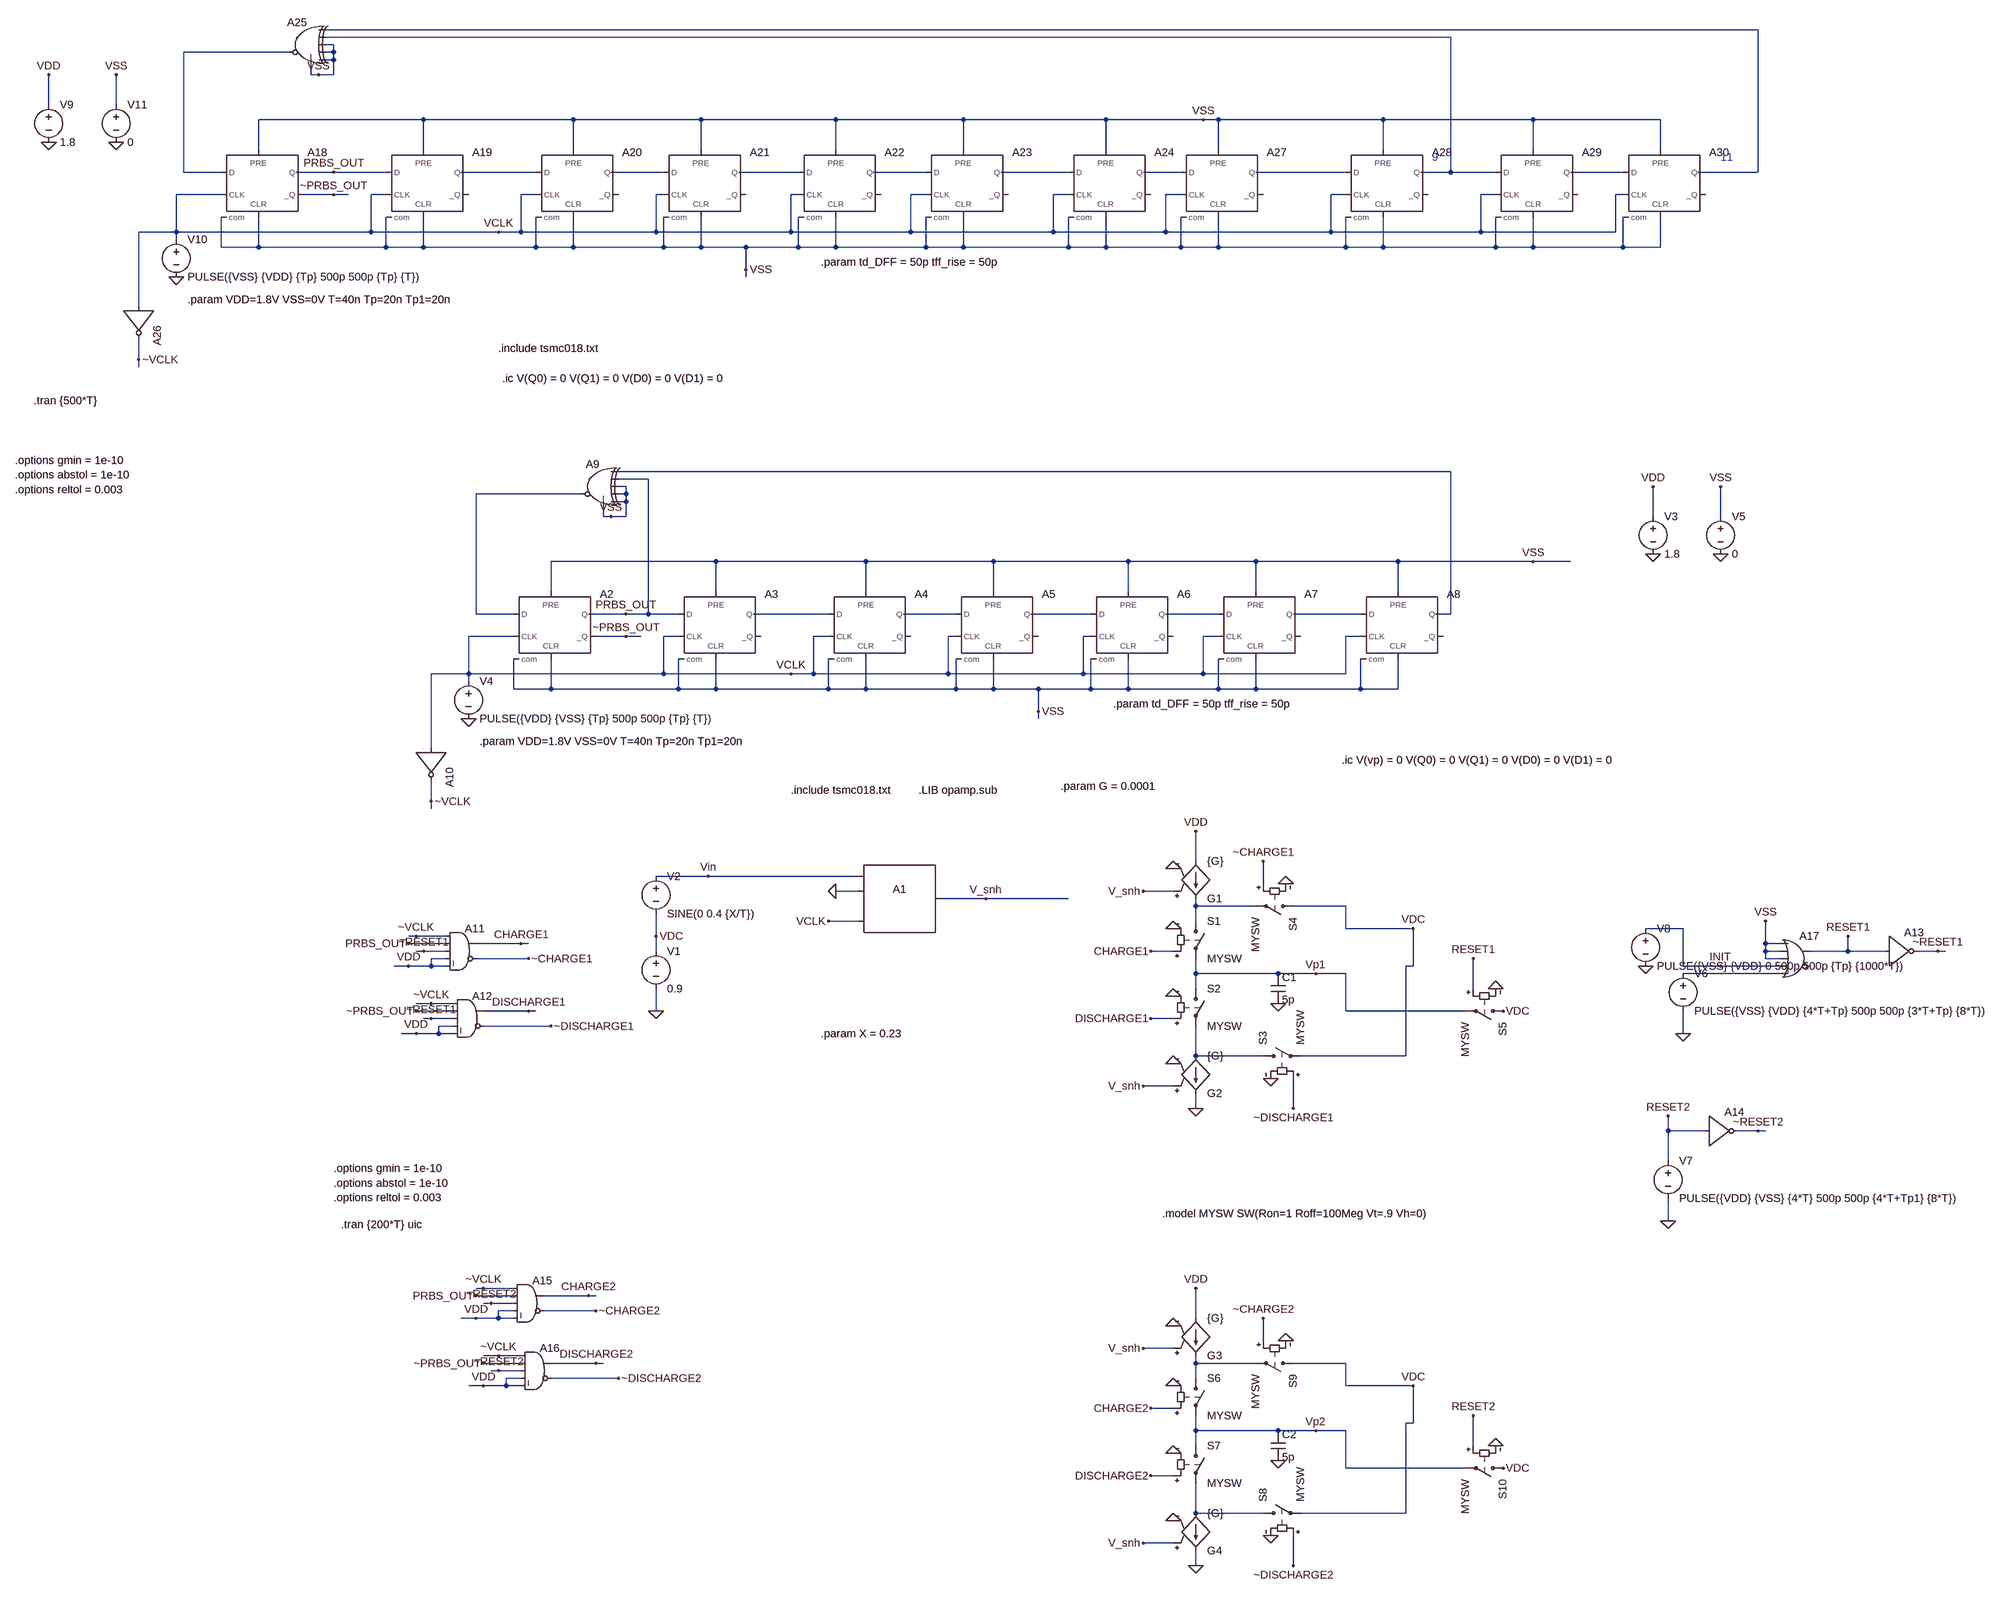
[diagram p0: schematic Draft3.asc]
Draft3.asc, the LTspice schematic file:
Version 4
SHEET 1 1940 1384
WIRE 1360 -2128 -1696 -2128
WIRE 704 -2112 -1696 -2112
WIRE -1680 -2096 -1696 -2096
WIRE -1776 -2080 -2000 -2080
WIRE -1680 -2080 -1680 -2096
WIRE -1680 -2080 -1696 -2080
WIRE -1680 -2064 -1680 -2080
WIRE -1680 -2064 -1696 -2064
WIRE -1728 -2032 -1728 -2064
WIRE -1712 -2032 -1728 -2032
WIRE -1680 -2032 -1680 -2064
WIRE -1680 -2032 -1712 -2032
WIRE -2288 -1968 -2288 -2032
WIRE -2144 -1968 -2144 -2032
WIRE -1488 -1936 -1840 -1936
WIRE -1168 -1936 -1488 -1936
WIRE -896 -1936 -1168 -1936
WIRE -608 -1936 -896 -1936
WIRE -336 -1936 -608 -1936
WIRE -32 -1936 -336 -1936
WIRE 176 -1936 -32 -1936
WIRE 208 -1936 176 -1936
WIRE 560 -1936 208 -1936
WIRE 880 -1936 560 -1936
WIRE 1152 -1936 880 -1936
WIRE -1840 -1872 -1840 -1936
WIRE -1488 -1872 -1488 -1936
WIRE -1168 -1872 -1168 -1936
WIRE -896 -1872 -896 -1936
WIRE -608 -1872 -608 -1936
WIRE -336 -1872 -336 -1936
WIRE -32 -1872 -32 -1936
WIRE 208 -1872 208 -1936
WIRE 560 -1872 560 -1936
WIRE 880 -1872 880 -1936
WIRE 1152 -1872 1152 -1936
WIRE -2000 -1824 -2000 -2080
WIRE -1920 -1824 -2000 -1824
WIRE -1680 -1824 -1760 -1824
WIRE -1568 -1824 -1680 -1824
WIRE -1248 -1824 -1408 -1824
WIRE -976 -1824 -1088 -1824
WIRE -688 -1824 -816 -1824
WIRE -416 -1824 -528 -1824
WIRE -112 -1824 -256 -1824
WIRE 128 -1824 48 -1824
WIRE 480 -1824 288 -1824
WIRE 704 -1824 704 -2112
WIRE 704 -1824 640 -1824
WIRE 800 -1824 704 -1824
WIRE 1072 -1824 960 -1824
WIRE 1360 -1824 1360 -2128
WIRE 1360 -1824 1232 -1824
WIRE -1920 -1776 -2016 -1776
WIRE -1680 -1776 -1744 -1776
WIRE -1648 -1776 -1680 -1776
WIRE -1568 -1776 -1600 -1776
WIRE -1248 -1776 -1280 -1776
WIRE -976 -1776 -992 -1776
WIRE -688 -1776 -704 -1776
WIRE -416 -1776 -448 -1776
WIRE -112 -1776 -144 -1776
WIRE 128 -1776 96 -1776
WIRE 480 -1776 448 -1776
WIRE 800 -1776 768 -1776
WIRE 1072 -1776 1056 -1776
WIRE -2016 -1696 -2016 -1776
WIRE -2016 -1696 -2096 -1696
WIRE -1600 -1696 -1600 -1776
WIRE -1600 -1696 -2016 -1696
WIRE -1328 -1696 -1600 -1696
WIRE -1280 -1696 -1280 -1776
WIRE -1280 -1696 -1328 -1696
WIRE -992 -1696 -992 -1776
WIRE -992 -1696 -1280 -1696
WIRE -704 -1696 -704 -1776
WIRE -704 -1696 -992 -1696
WIRE -448 -1696 -448 -1776
WIRE -448 -1696 -704 -1696
WIRE -144 -1696 -144 -1776
WIRE -144 -1696 -448 -1696
WIRE 96 -1696 96 -1776
WIRE 96 -1696 -144 -1696
WIRE 448 -1696 448 -1776
WIRE 448 -1696 96 -1696
WIRE 768 -1696 768 -1776
WIRE 768 -1696 448 -1696
WIRE 1056 -1696 1056 -1776
WIRE 1056 -1696 768 -1696
WIRE -2016 -1680 -2016 -1696
WIRE -1920 -1664 -1920 -1728
WIRE -1840 -1664 -1840 -1728
WIRE -1840 -1664 -1920 -1664
WIRE -1568 -1664 -1568 -1728
WIRE -1568 -1664 -1840 -1664
WIRE -1488 -1664 -1488 -1728
WIRE -1488 -1664 -1568 -1664
WIRE -1248 -1664 -1248 -1728
WIRE -1248 -1664 -1488 -1664
WIRE -1168 -1664 -1168 -1728
WIRE -1168 -1664 -1248 -1664
WIRE -976 -1664 -976 -1728
WIRE -976 -1664 -1168 -1664
WIRE -896 -1664 -896 -1728
WIRE -896 -1664 -976 -1664
WIRE -800 -1664 -896 -1664
WIRE -688 -1664 -688 -1728
WIRE -688 -1664 -800 -1664
WIRE -608 -1664 -608 -1728
WIRE -608 -1664 -688 -1664
WIRE -416 -1664 -416 -1728
WIRE -416 -1664 -608 -1664
WIRE -336 -1664 -336 -1728
WIRE -336 -1664 -416 -1664
WIRE -112 -1664 -112 -1728
WIRE -112 -1664 -336 -1664
WIRE -32 -1664 -32 -1728
WIRE -32 -1664 -112 -1664
WIRE 128 -1664 128 -1728
WIRE 128 -1664 -32 -1664
WIRE 208 -1664 208 -1728
WIRE 208 -1664 128 -1664
WIRE 480 -1664 480 -1728
WIRE 480 -1664 208 -1664
WIRE 560 -1664 560 -1728
WIRE 560 -1664 480 -1664
WIRE 800 -1664 800 -1728
WIRE 800 -1664 560 -1664
WIRE 880 -1664 880 -1728
WIRE 880 -1664 800 -1664
WIRE 1072 -1664 1072 -1728
WIRE 1072 -1664 880 -1664
WIRE 1152 -1664 1152 -1728
WIRE 1152 -1664 1072 -1664
WIRE -800 -1616 -800 -1664
WIRE -800 -1600 -800 -1616
WIRE -2096 -1536 -2096 -1696
WIRE -2096 -1424 -2096 -1472
WIRE -2096 -1408 -2096 -1424
WIRE 704 -1168 -1072 -1168
WIRE -1008 -1152 -1072 -1152
WIRE -1056 -1136 -1072 -1136
WIRE -1152 -1120 -1376 -1120
WIRE -1056 -1120 -1056 -1136
WIRE -1056 -1120 -1072 -1120
WIRE -1056 -1104 -1056 -1120
WIRE -1056 -1104 -1072 -1104
WIRE -1104 -1072 -1104 -1104
WIRE -1088 -1072 -1104 -1072
WIRE -1056 -1072 -1056 -1104
WIRE -1056 -1072 -1088 -1072
WIRE 1136 -1072 1136 -1136
WIRE 1280 -1072 1280 -1136
WIRE -864 -976 -1216 -976
WIRE -544 -976 -864 -976
WIRE -272 -976 -544 -976
WIRE 16 -976 -272 -976
WIRE 288 -976 16 -976
WIRE 592 -976 288 -976
WIRE 880 -976 592 -976
WIRE 960 -976 880 -976
WIRE -1216 -912 -1216 -976
WIRE -864 -912 -864 -976
WIRE -544 -912 -544 -976
WIRE -272 -912 -272 -976
WIRE 16 -912 16 -976
WIRE 288 -912 288 -976
WIRE 592 -912 592 -976
WIRE -1376 -864 -1376 -1120
WIRE -1296 -864 -1376 -864
WIRE -1056 -864 -1136 -864
WIRE -1008 -864 -1008 -1152
WIRE -1008 -864 -1056 -864
WIRE -944 -864 -1008 -864
WIRE -624 -864 -784 -864
WIRE -352 -864 -464 -864
WIRE -64 -864 -192 -864
WIRE 208 -864 96 -864
WIRE 512 -864 368 -864
WIRE 704 -864 704 -1168
WIRE 704 -864 672 -864
WIRE -1296 -816 -1392 -816
WIRE -1056 -816 -1120 -816
WIRE -1024 -816 -1056 -816
WIRE -944 -816 -976 -816
WIRE -624 -816 -656 -816
WIRE -352 -816 -368 -816
WIRE -64 -816 -80 -816
WIRE 208 -816 176 -816
WIRE 512 -816 480 -816
WIRE -1392 -736 -1392 -816
WIRE -1392 -736 -1472 -736
WIRE -976 -736 -976 -816
WIRE -976 -736 -1392 -736
WIRE -704 -736 -976 -736
WIRE -656 -736 -656 -816
WIRE -656 -736 -704 -736
WIRE -368 -736 -368 -816
WIRE -368 -736 -656 -736
WIRE -80 -736 -80 -816
WIRE -80 -736 -368 -736
WIRE 176 -736 176 -816
WIRE 176 -736 -80 -736
WIRE 480 -736 480 -816
WIRE 480 -736 176 -736
WIRE -1392 -720 -1392 -736
WIRE -1296 -704 -1296 -768
WIRE -1216 -704 -1216 -768
WIRE -1216 -704 -1296 -704
WIRE -944 -704 -944 -768
WIRE -944 -704 -1216 -704
WIRE -864 -704 -864 -768
WIRE -864 -704 -944 -704
WIRE -624 -704 -624 -768
WIRE -624 -704 -864 -704
WIRE -544 -704 -544 -768
WIRE -544 -704 -624 -704
WIRE -352 -704 -352 -768
WIRE -352 -704 -544 -704
WIRE -272 -704 -272 -768
WIRE -272 -704 -352 -704
WIRE -176 -704 -272 -704
WIRE -64 -704 -64 -768
WIRE -64 -704 -176 -704
WIRE 16 -704 16 -768
WIRE 16 -704 -64 -704
WIRE 208 -704 208 -768
WIRE 208 -704 16 -704
WIRE 288 -704 288 -768
WIRE 288 -704 208 -704
WIRE 512 -704 512 -768
WIRE 512 -704 288 -704
WIRE 592 -704 592 -768
WIRE 592 -704 512 -704
WIRE -176 -656 -176 -704
WIRE -176 -640 -176 -656
WIRE -1472 -576 -1472 -736
WIRE -1472 -464 -1472 -512
WIRE -1472 -448 -1472 -464
WIRE 160 -336 160 -400
WIRE -880 -304 -992 -304
WIRE -560 -304 -880 -304
WIRE 304 -288 304 -336
WIRE -560 -272 -608 -272
WIRE 112 -272 48 -272
WIRE -288 -256 -384 -256
WIRE -112 -256 -288 -256
WIRE 160 -240 160 -256
WIRE 288 -240 160 -240
WIRE 480 -240 368 -240
WIRE -560 -208 -624 -208
WIRE 160 -208 160 -240
WIRE 480 -192 480 -240
WIRE 624 -192 480 -192
WIRE 1200 -192 1120 -192
WIRE -1504 -176 -1520 -176
WIRE -1440 -176 -1504 -176
WIRE -992 -176 -992 -224
WIRE -1440 -160 -1520 -160
WIRE -1280 -160 -1376 -160
WIRE -1264 -160 -1280 -160
WIRE 1376 -160 1376 -208
WIRE 1408 -160 1376 -160
WIRE -1488 -144 -1504 -144
WIRE -1440 -144 -1488 -144
WIRE -992 -144 -992 -176
WIRE 112 -144 64 -144
WIRE 1376 -144 1376 -160
WIRE 1408 -144 1376 -144
WIRE 1552 -144 1552 -176
WIRE 1552 -144 1472 -144
WIRE 1632 -144 1552 -144
WIRE 1744 -144 1696 -144
WIRE 1760 -144 1744 -144
WIRE -1440 -128 -1472 -128
WIRE -1264 -128 -1376 -128
WIRE 1376 -128 1376 -144
WIRE 1408 -128 1376 -128
WIRE -1520 -112 -1552 -112
WIRE -1472 -112 -1472 -128
WIRE -1472 -112 -1520 -112
WIRE -1440 -112 -1472 -112
WIRE 624 -112 624 -192
WIRE 624 -112 608 -112
WIRE 1200 -112 1200 -192
WIRE 1280 -112 1200 -112
WIRE 1408 -112 1280 -112
WIRE 160 -96 160 -128
WIRE 336 -96 160 -96
WIRE 416 -96 336 -96
WIRE 480 -96 416 -96
WIRE 1408 -96 1200 -96
WIRE 160 -64 160 -96
WIRE 752 -64 752 -128
WIRE -1472 -32 -1504 -32
WIRE -1424 -32 -1472 -32
WIRE -1424 -16 -1504 -16
WIRE -1264 -16 -1360 -16
WIRE -1248 -16 -1264 -16
WIRE -992 -16 -992 -64
WIRE 480 -16 480 -96
WIRE 736 -16 480 -16
WIRE -1472 0 -1488 0
WIRE -1424 0 -1472 0
WIRE 112 0 64 0
WIRE -1424 16 -1456 16
WIRE -1216 16 -1360 16
WIRE -1504 32 -1536 32
WIRE -1456 32 -1456 16
WIRE -1456 32 -1504 32
WIRE -1424 32 -1456 32
WIRE 1200 32 1200 -16
WIRE 160 80 160 16
WIRE 304 80 160 80
WIRE 608 80 608 -112
WIRE 608 80 384 80
WIRE 112 144 48 144
WIRE 160 192 160 160
WIRE 368 192 368 128
WIRE 1168 240 1168 208
WIRE 1248 240 1168 240
WIRE 1360 240 1312 240
WIRE 1376 240 1360 240
WIRE 1168 304 1168 240
WIRE 1168 432 1168 384
WIRE -1360 576 -1376 576
WIRE -1296 576 -1360 576
WIRE -1296 592 -1376 592
WIRE -1136 592 -1232 592
WIRE -1120 592 -1136 592
WIRE -1344 608 -1360 608
WIRE -1296 608 -1344 608
WIRE -1296 624 -1328 624
WIRE -1120 624 -1232 624
WIRE -1376 640 -1408 640
WIRE -1328 640 -1328 624
WIRE -1328 640 -1376 640
WIRE -1296 640 -1328 640
WIRE 160 640 160 576
WIRE 304 688 304 640
WIRE 112 704 48 704
WIRE -1328 720 -1360 720
WIRE -1280 720 -1328 720
WIRE -1280 736 -1360 736
WIRE -1120 736 -1216 736
WIRE -1104 736 -1120 736
WIRE 160 736 160 720
WIRE 288 736 160 736
WIRE 480 736 368 736
WIRE -1328 752 -1344 752
WIRE -1280 752 -1328 752
WIRE -1280 768 -1312 768
WIRE -1072 768 -1216 768
WIRE 160 768 160 736
WIRE -1360 784 -1392 784
WIRE -1312 784 -1312 768
WIRE -1312 784 -1360 784
WIRE -1280 784 -1312 784
WIRE 480 784 480 736
WIRE 624 784 480 784
WIRE 112 832 64 832
WIRE 624 864 624 784
WIRE 624 864 608 864
WIRE 160 880 160 848
WIRE 336 880 160 880
WIRE 416 880 336 880
WIRE 480 880 416 880
WIRE 160 912 160 880
WIRE 752 912 752 848
WIRE 480 960 480 880
WIRE 736 960 480 960
WIRE 112 976 64 976
WIRE 160 1056 160 992
WIRE 304 1056 160 1056
WIRE 608 1056 608 864
WIRE 608 1056 384 1056
WIRE 112 1120 48 1120
WIRE 160 1168 160 1136
WIRE 368 1168 368 1104
FLAG -992 -16 0
FLAG -992 -176 VDC
FLAG -880 -304 Vin
FLAG -608 -272 0
FLAG 1136 -992 0
FLAG 1136 -1136 VDD
FLAG -624 -208 VCLK
FLAG -288 -256 V_snh
FLAG -1392 -640 0
FLAG -1088 -1072 VSS
FLAG -176 -656 VSS
FLAG -1056 -864 PRBS_OUT
FLAG -1056 -816 ~PRBS_OUT
FLAG 880 -976 VSS
FLAG -704 -736 VCLK
FLAG -1472 -464 ~VCLK
FLAG 160 192 0
FLAG 160 -400 VDD
FLAG 336 -32 0
FLAG 112 96 0
FLAG 112 -320 0
FLAG 416 -96 Vp1
FLAG 624 -192 VDC
FLAG 48 -272 V_snh
FLAG 48 144 V_snh
FLAG 112 -192 0
FLAG 112 -48 0
FLAG 320 128 0
FLAG 352 -288 0
FLAG 800 -64 0
FLAG -1520 -160 PRBS_OUT
FLAG -1280 -160 CHARGE1
FLAG -1488 -144 ~RESET1
FLAG -1520 -112 VDD
FLAG -1504 -16 ~PRBS_OUT
FLAG -1264 -16 DISCHARGE1
FLAG -1472 0 ~RESET1
FLAG -1504 32 VDD
FLAG -1504 -176 ~VCLK
FLAG -1472 -32 ~VCLK
FLAG 64 -144 CHARGE1
FLAG 304 -336 ~CHARGE1
FLAG 64 0 DISCHARGE1
FLAG 368 192 ~DISCHARGE1
FLAG 752 -128 RESET1
FLAG -1264 -128 ~CHARGE1
FLAG -1216 16 ~DISCHARGE1
FLAG 1280 -992 0
FLAG 1280 -1136 VSS
FLAG 1200 32 0
FLAG 1552 -176 RESET1
FLAG 816 -16 VDC
FLAG 1744 -144 ~RESET1
FLAG 160 1168 0
FLAG 160 576 VDD
FLAG 336 944 0
FLAG 112 1072 0
FLAG 112 656 0
FLAG 416 880 Vp2
FLAG 624 784 VDC
FLAG 48 704 V_snh
FLAG 48 1120 V_snh
FLAG 112 784 0
FLAG 112 928 0
FLAG 320 1104 0
FLAG 352 688 0
FLAG 800 912 0
FLAG 64 832 CHARGE2
FLAG 304 640 ~CHARGE2
FLAG 64 976 DISCHARGE2
FLAG 368 1168 ~DISCHARGE2
FLAG 752 848 RESET2
FLAG 816 960 VDC
FLAG 1168 432 0
FLAG 1168 208 RESET2
FLAG 1360 240 ~RESET2
FLAG -1376 592 PRBS_OUT
FLAG -1136 592 CHARGE2
FLAG -1344 608 ~RESET2
FLAG -1376 640 VDD
FLAG -1360 736 ~PRBS_OUT
FLAG -1120 736 DISCHARGE2
FLAG -1328 752 ~RESET2
FLAG -1360 784 VDD
FLAG -1360 576 ~VCLK
FLAG -1328 720 ~VCLK
FLAG -1120 624 ~CHARGE2
FLAG -1072 768 ~DISCHARGE2
FLAG 1376 -208 VSS
FLAG 1120 -112 0
FLAG 1280 -112 INIT
FLAG -2288 -1888 0
FLAG -2288 -2032 VDD
FLAG -2016 -1600 0
FLAG -1712 -2032 VSS
FLAG -800 -1616 VSS
FLAG -1680 -1824 PRBS_OUT
FLAG -1680 -1776 ~PRBS_OUT
FLAG 176 -1936 VSS
FLAG -1328 -1696 VCLK
FLAG -2096 -1424 ~VCLK
FLAG -2144 -1888 0
FLAG -2144 -2032 VSS
SYMBOL voltage -992 -160 R0
WINDOW 123 0 0 Left 0
WINDOW 39 0 0 Left 0
SYMATTR InstName V1
SYMATTR Value 0.9
SYMBOL voltage -992 -320 R0
WINDOW 123 0 0 Left 0
WINDOW 39 0 0 Left 0
SYMATTR InstName V2
SYMATTR Value SINE(0 0.4 {X/T})
SYMBOL SpecialFunctions\\sample -480 -272 R0
SYMATTR InstName A1
SYMBOL voltage 1136 -1088 R0
WINDOW 123 0 0 Left 0
WINDOW 39 0 0 Left 0
SYMATTR InstName V3
SYMATTR Value 1.8
SYMBOL Digital\\dflop -1216 -912 R0
SYMATTR InstName A2
SYMATTR SpiceLine Trise = {tff_rise} Tfall = {tff_rise} Td = {td_DFF}
SYMATTR Value2 Vhigh = 1.8 Vlow = 0
SYMBOL Digital\\dflop -864 -912 R0
SYMATTR InstName A3
SYMATTR SpiceLine Trise = {tff_rise} Tfall = {tff_rise} Td = {td_DFF}
SYMATTR Value2 Vhigh = 1.8 Vlow = 0
SYMBOL Digital\\dflop -544 -912 R0
SYMATTR InstName A4
SYMATTR SpiceLine Trise = {tff_rise} Tfall = {tff_rise} Td = {td_DFF}
SYMATTR Value2 Vhigh = 1.8 Vlow = 0
SYMBOL Digital\\dflop -272 -912 R0
SYMATTR InstName A5
SYMATTR SpiceLine Trise = {tff_rise} Tfall = {tff_rise} Td = {td_DFF}
SYMATTR Value2 Vhigh = 1.8 Vlow = 0
SYMBOL Digital\\dflop 16 -912 R0
SYMATTR InstName A6
SYMATTR SpiceLine Trise = {tff_rise} Tfall = {tff_rise} Td = {td_DFF}
SYMATTR Value2 Vhigh = 1.8 Vlow = 0
SYMBOL Digital\\dflop 288 -912 R0
SYMATTR InstName A7
SYMATTR SpiceLine Trise = {tff_rise} Tfall = {tff_rise} Td = {td_DFF}
SYMATTR Value2 Vhigh = 1.8 Vlow = 0
SYMBOL Digital\\dflop 592 -912 R0
SYMATTR InstName A8
SYMATTR SpiceLine Trise = {tff_rise} Tfall = {tff_rise} Td = {td_DFF}
SYMATTR Value2 Vhigh = 1.8 Vlow = 0
SYMBOL Digital\\xor -1120 -1200 M0
SYMATTR InstName A9
SYMATTR Value2 Vhigh = 1.8 Vlow = 0
SYMATTR SpiceLine Trise = {tff_rise} Tfall = {tff_rise} Td = {td_DFF}
SYMBOL voltage -1392 -736 R0
WINDOW 123 0 0 Left 0
WINDOW 39 0 0 Left 0
SYMATTR InstName V4
SYMATTR Value PULSE({VDD} {VSS} {Tp} 500p 500p {Tp} {T})
SYMBOL Digital\\inv -1408 -576 R90
SYMATTR InstName A10
SYMATTR Value2 Vhigh = 1.8 Vlow = 0
SYMATTR SpiceLine Trise = {tff_rise} Tfall = {tff_rise} Td = {td_DFF}
SYMBOL g 160 -240 M180
SYMATTR InstName G1
SYMATTR Value {G}
SYMBOL g 160 176 M180
SYMATTR InstName G2
SYMATTR Value {G}
SYMBOL sw 160 -224 R0
SYMATTR InstName S1
SYMATTR Value MYSW
SYMBOL sw 160 -80 R0
SYMATTR InstName S2
SYMATTR Value MYSW
SYMBOL sw 288 80 R270
SYMATTR InstName S3
SYMATTR Value MYSW
SYMBOL sw 384 -240 R90
SYMATTR InstName S4
SYMATTR Value MYSW
SYMBOL cap 320 -96 R0
SYMATTR InstName C1
SYMATTR Value 5p
SYMBOL sw 832 -16 R90
SYMATTR InstName S5
SYMATTR Value MYSW
SYMBOL Digital\\and -1408 -208 R0
SYMATTR InstName A11
SYMATTR Value2 Vhigh = 1.8 Vlow = 0
SYMATTR SpiceLine Trise = {tff_rise} Tfall = {tff_rise} Td = {td_DFF}
SYMBOL Digital\\and -1392 -64 R0
SYMATTR InstName A12
SYMATTR Value2 Vhigh = 1.8 Vlow = 0
SYMATTR SpiceLine Trise = {tff_rise} Tfall = {tff_rise} Td = {td_DFF}
SYMBOL voltage 1280 -1088 R0
WINDOW 123 0 0 Left 0
WINDOW 39 0 0 Left 0
SYMATTR InstName V5
SYMATTR Value 0
SYMBOL voltage 1200 -112 R0
WINDOW 123 0 0 Left 0
WINDOW 39 0 0 Left 0
SYMATTR InstName V6
SYMATTR Value PULSE({VSS} {VDD} {4*T+Tp} 500p 500p {3*T+Tp} {8*T})
SYMBOL Digital\\inv 1632 -208 R0
SYMATTR InstName A13
SYMATTR Value2 Vhigh = 1.8 Vlow = 0
SYMATTR SpiceLine Trise = {tff_rise} Tfall = {tff_rise} Td = {td_DFF}
SYMBOL g 160 736 M180
SYMATTR InstName G3
SYMATTR Value {G}
SYMBOL g 160 1152 M180
SYMATTR InstName G4
SYMATTR Value {G}
SYMBOL sw 160 752 R0
SYMATTR InstName S6
SYMATTR Value MYSW
SYMBOL sw 160 896 R0
SYMATTR InstName S7
SYMATTR Value MYSW
SYMBOL sw 288 1056 R270
SYMATTR InstName S8
SYMATTR Value MYSW
SYMBOL sw 384 736 R90
SYMATTR InstName S9
SYMATTR Value MYSW
SYMBOL cap 320 880 R0
SYMATTR InstName C2
SYMATTR Value 5p
SYMBOL sw 832 960 R90
SYMATTR InstName S10
SYMATTR Value MYSW
SYMBOL voltage 1168 288 R0
WINDOW 123 0 0 Left 0
WINDOW 39 0 0 Left 0
SYMATTR InstName V7
SYMATTR Value PULSE({VDD} {VSS} {4*T} 500p 500p {4*T+Tp1} {8*T})
SYMBOL Digital\\inv 1248 176 R0
SYMATTR InstName A14
SYMATTR Value2 Vhigh = 1.8 Vlow = 0
SYMATTR SpiceLine Trise = {tff_rise} Tfall = {tff_rise} Td = {td_DFF}
SYMBOL Digital\\and -1264 544 R0
SYMATTR InstName A15
SYMATTR Value2 Vhigh = 1.8 Vlow = 0
SYMATTR SpiceLine Trise = {tff_rise} Tfall = {tff_rise} Td = {td_DFF}
SYMBOL Digital\\and -1248 688 R0
SYMATTR InstName A16
SYMATTR Value2 Vhigh = 1.8 Vlow = 0
SYMATTR SpiceLine Trise = {tff_rise} Tfall = {tff_rise} Td = {td_DFF}
SYMBOL Digital\\or 1440 -192 R0
SYMATTR InstName A17
SYMATTR Value2 Vhigh = 1.8 Vlow = 0
SYMATTR SpiceLine Trise = {tff_rise} Tfall = {tff_rise} Td = {td_DFF}
SYMBOL voltage 1120 -208 R0
WINDOW 123 0 0 Left 0
WINDOW 39 0 0 Left 0
SYMATTR InstName V8
SYMATTR Value PULSE({VSS} {VDD} 0 500p 500p {Tp} {1000*T})
SYMBOL voltage -2288 -1984 R0
WINDOW 123 0 0 Left 0
WINDOW 39 0 0 Left 0
SYMATTR InstName V9
SYMATTR Value 1.8
SYMBOL Digital\\dflop -1840 -1872 R0
SYMATTR InstName A18
SYMATTR SpiceLine Trise = {tff_rise} Tfall = {tff_rise} Td = {td_DFF}
SYMATTR Value2 Vhigh = 1.8 Vlow = 0
SYMBOL Digital\\dflop -1488 -1872 R0
SYMATTR InstName A19
SYMATTR SpiceLine Trise = {tff_rise} Tfall = {tff_rise} Td = {td_DFF}
SYMATTR Value2 Vhigh = 1.8 Vlow = 0
SYMBOL Digital\\dflop -1168 -1872 R0
SYMATTR InstName A20
SYMATTR SpiceLine Trise = {tff_rise} Tfall = {tff_rise} Td = {td_DFF}
SYMATTR Value2 Vhigh = 1.8 Vlow = 0
SYMBOL Digital\\dflop -896 -1872 R0
SYMATTR InstName A21
SYMATTR SpiceLine Trise = {tff_rise} Tfall = {tff_rise} Td = {td_DFF}
SYMATTR Value2 Vhigh = 1.8 Vlow = 0
SYMBOL Digital\\dflop -608 -1872 R0
SYMATTR InstName A22
SYMATTR SpiceLine Trise = {tff_rise} Tfall = {tff_rise} Td = {td_DFF}
SYMATTR Value2 Vhigh = 1.8 Vlow = 0
SYMBOL Digital\\dflop -336 -1872 R0
SYMATTR InstName A23
SYMATTR SpiceLine Trise = {tff_rise} Tfall = {tff_rise} Td = {td_DFF}
SYMATTR Value2 Vhigh = 1.8 Vlow = 0
SYMBOL Digital\\dflop -32 -1872 R0
SYMATTR InstName A24
SYMATTR SpiceLine Trise = {tff_rise} Tfall = {tff_rise} Td = {td_DFF}
SYMATTR Value2 Vhigh = 1.8 Vlow = 0
SYMBOL Digital\\xor -1744 -2160 M0
SYMATTR InstName A25
SYMATTR Value2 Vhigh = 1.8 Vlow = 0
SYMATTR SpiceLine Trise = {tff_rise} Tfall = {tff_rise} Td = {td_DFF}
SYMBOL voltage -2016 -1696 R0
WINDOW 123 0 0 Left 0
WINDOW 39 0 0 Left 0
SYMATTR InstName V10
SYMATTR Value PULSE({VSS} {VDD} {Tp} 500p 500p {Tp} {T})
SYMBOL Digital\\inv -2032 -1536 R90
SYMATTR InstName A26
SYMATTR Value2 Vhigh = 1.8 Vlow = 0
SYMATTR SpiceLine Trise = {tff_rise} Tfall = {tff_rise} Td = {td_DFF}
SYMBOL voltage -2144 -1984 R0
WINDOW 123 0 0 Left 0
WINDOW 39 0 0 Left 0
SYMATTR InstName V11
SYMATTR Value 0
SYMBOL Digital\\dflop 208 -1872 R0
SYMATTR InstName A27
SYMATTR SpiceLine Trise = {tff_rise} Tfall = {tff_rise} Td = {td_DFF}
SYMATTR Value2 Vhigh = 1.8 Vlow = 0
SYMBOL Digital\\dflop 560 -1872 R0
SYMATTR InstName A28
SYMATTR SpiceLine Trise = {tff_rise} Tfall = {tff_rise} Td = {td_DFF}
SYMATTR Value2 Vhigh = 1.8 Vlow = 0
SYMBOL Digital\\dflop 880 -1872 R0
SYMATTR InstName A29
SYMATTR SpiceLine Trise = {tff_rise} Tfall = {tff_rise} Td = {td_DFF}
SYMATTR Value2 Vhigh = 1.8 Vlow = 0
SYMBOL Digital\\dflop 1152 -1872 R0
SYMATTR InstName A30
SYMATTR SpiceLine Trise = {tff_rise} Tfall = {tff_rise} Td = {td_DFF}
SYMATTR Value2 Vhigh = 1.8 Vlow = 0
TEXT -704 -488 Left 2 !.include tsmc018.txt
TEXT -432 -488 Left 2 !.LIB opamp.sub
TEXT 88 416 Left 2 !.model MYSW SW(Ron=1 Roff=100Meg Vt=.9 Vh=0)
TEXT 472 -552 Left 2 !.ic V(vp) = 0 V(Q0) = 0 V(Q1) = 0 V(D0) = 0 V(D1) = 0
TEXT -1680 320 Left 2 !.options gmin = 1e-10\n.options abstol = 1e-10\n.options reltol = 0.003
TEXT -128 -496 Left 2 !.param G = 0.0001
TEXT -1664 440 Left 2 !.tran {200*T} uic
TEXT -16 -672 Left 2 !.param td_DFF = 50p tff_rise = 50p
TEXT -1368 -592 Left 2 !.param VDD=1.8V VSS=0V T=40n Tp=20n Tp1=20n
TEXT -640 32 Left 2 !.param X = 0.23
TEXT -1328 -1448 Left 2 !.include tsmc018.txt
TEXT -640 -1632 Left 2 !.param td_DFF = 50p tff_rise = 50p
TEXT -1992 -1552 Left 2 !.param VDD=1.8V VSS=0V T=40n Tp=20n Tp1=20n
TEXT -2320 -1336 Left 2 !.tran {500*T}
TEXT -2360 -1192 Left 2 !.options gmin = 1e-10\n.options abstol = 1e-10\n.options reltol = 0.003
TEXT -1320 -1384 Left 2 !.ic V(Q0) = 0 V(Q1) = 0 V(D0) = 0 V(D1) = 0
TEXT 1280 -1856 Left 2 ;11
TEXT 664 -1856 Left 2 ;9

The netlist it stands for:
* Draft3.asc
V1 VDC 0 0.9
V2 Vin VDC SINE(0 0.4 {X/T})
A1 Vin 0 0 VCLK 0 0 V_snh 0 SAMPLEHOLD
V3 VDD 0 1.8
A2 N013 VSS VCLK VSS VSS ~PRBS_OUT PRBS_OUT VSS DFLOP Vhigh = 1.8 Vlow = 0 Trise = {tff_rise} Tfall = {tff_rise} Td = {td_DFF}
A3 PRBS_OUT VSS VCLK VSS VSS VSS N014 VSS DFLOP Vhigh = 1.8 Vlow = 0 Trise = {tff_rise} Tfall = {tff_rise} Td = {td_DFF}
A4 N014 VSS VCLK VSS VSS VSS N015 VSS DFLOP Vhigh = 1.8 Vlow = 0 Trise = {tff_rise} Tfall = {tff_rise} Td = {td_DFF}
A5 N015 VSS VCLK VSS VSS VSS N016 VSS DFLOP Vhigh = 1.8 Vlow = 0 Trise = {tff_rise} Tfall = {tff_rise} Td = {td_DFF}
A6 N016 VSS VCLK VSS VSS VSS N017 VSS DFLOP Vhigh = 1.8 Vlow = 0 Trise = {tff_rise} Tfall = {tff_rise} Td = {td_DFF}
A7 N017 VSS VCLK VSS VSS VSS N018 VSS DFLOP Vhigh = 1.8 Vlow = 0 Trise = {tff_rise} Tfall = {tff_rise} Td = {td_DFF}
A8 N018 VSS VCLK VSS VSS VSS N012 VSS DFLOP Vhigh = 1.8 Vlow = 0 Trise = {tff_rise} Tfall = {tff_rise} Td = {td_DFF}
A9 N012 PRBS_OUT VSS VSS VSS N013 VSS VSS XOR Vhigh = 1.8 Vlow = 0 Trise = {tff_rise} Tfall = {tff_rise} Td = {td_DFF}
V4 VCLK 0 PULSE({VDD} {VSS} {Tp} 500p 500p {Tp} {T})
A10 VCLK 0 0 0 0 ~VCLK 0 0 BUF Vhigh = 1.8 Vlow = 0 Trise = {tff_rise} Tfall = {tff_rise} Td = {td_DFF}
G1 VDD N019 V_snh 0 {G}
G2 N021 0 V_snh 0 {G}
S1 N019 Vp1 CHARGE1 0 MYSW
S2 Vp1 N021 DISCHARGE1 0 MYSW
S3 N021 VDC ~DISCHARGE1 0 MYSW
S4 VDC N019 ~CHARGE1 0 MYSW
C1 Vp1 0 5p
S5 VDC Vp1 RESET1 0 MYSW
A11 ~VCLK PRBS_OUT ~RESET1 VDD VDD ~CHARGE1 CHARGE1 0 AND Vhigh = 1.8 Vlow = 0 Trise = {tff_rise} Tfall = {tff_rise} Td = {td_DFF}
A12 ~VCLK ~PRBS_OUT ~RESET1 VDD VDD ~DISCHARGE1 DISCHARGE1 0 AND Vhigh = 1.8 Vlow = 0 Trise = {tff_rise} Tfall = {tff_rise} Td = {td_DFF}
V5 VSS 0 0
V6 N020 0 PULSE({VSS} {VDD} {4*T+Tp} 500p 500p {3*T+Tp} {8*T})
A13 RESET1 0 0 0 0 ~RESET1 0 0 BUF Vhigh = 1.8 Vlow = 0 Trise = {tff_rise} Tfall = {tff_rise} Td = {td_DFF}
G3 VDD N022 V_snh 0 {G}
G4 N023 0 V_snh 0 {G}
S6 N022 Vp2 CHARGE2 0 MYSW
S7 Vp2 N023 DISCHARGE2 0 MYSW
S8 N023 VDC ~DISCHARGE2 0 MYSW
S9 VDC N022 ~CHARGE2 0 MYSW
C2 Vp2 0 5p
S10 VDC Vp2 RESET2 0 MYSW
V7 RESET2 0 PULSE({VDD} {VSS} {4*T} 500p 500p {4*T+Tp1} {8*T})
A14 RESET2 0 0 0 0 ~RESET2 0 0 BUF Vhigh = 1.8 Vlow = 0 Trise = {tff_rise} Tfall = {tff_rise} Td = {td_DFF}
A15 ~VCLK PRBS_OUT ~RESET2 VDD VDD ~CHARGE2 CHARGE2 0 AND Vhigh = 1.8 Vlow = 0 Trise = {tff_rise} Tfall = {tff_rise} Td = {td_DFF}
A16 ~VCLK ~PRBS_OUT ~RESET2 VDD VDD ~DISCHARGE2 DISCHARGE2 0 AND Vhigh = 1.8 Vlow = 0 Trise = {tff_rise} Tfall = {tff_rise} Td = {td_DFF}
A17 VSS VSS VSS INIT N020 0 RESET1 0 OR Vhigh = 1.8 Vlow = 0 Trise = {tff_rise} Tfall = {tff_rise} Td = {td_DFF}
V8 INIT 0 PULSE({VSS} {VDD} 0 500p 500p {Tp} {1000*T})
V9 VDD 0 1.8
A18 N003 VSS VCLK VSS VSS ~PRBS_OUT PRBS_OUT VSS DFLOP Vhigh = 1.8 Vlow = 0 Trise = {tff_rise} Tfall = {tff_rise} Td = {td_DFF}
A19 PRBS_OUT VSS VCLK VSS VSS VSS N004 VSS DFLOP Vhigh = 1.8 Vlow = 0 Trise = {tff_rise} Tfall = {tff_rise} Td = {td_DFF}
A20 N004 VSS VCLK VSS VSS VSS N005 VSS DFLOP Vhigh = 1.8 Vlow = 0 Trise = {tff_rise} Tfall = {tff_rise} Td = {td_DFF}
A21 N005 VSS VCLK VSS VSS VSS N006 VSS DFLOP Vhigh = 1.8 Vlow = 0 Trise = {tff_rise} Tfall = {tff_rise} Td = {td_DFF}
A22 N006 VSS VCLK VSS VSS VSS N007 VSS DFLOP Vhigh = 1.8 Vlow = 0 Trise = {tff_rise} Tfall = {tff_rise} Td = {td_DFF}
A23 N007 VSS VCLK VSS VSS VSS N008 VSS DFLOP Vhigh = 1.8 Vlow = 0 Trise = {tff_rise} Tfall = {tff_rise} Td = {td_DFF}
A24 N008 VSS VCLK VSS VSS VSS N009 VSS DFLOP Vhigh = 1.8 Vlow = 0 Trise = {tff_rise} Tfall = {tff_rise} Td = {td_DFF}
A25 N001 N002 VSS VSS VSS N003 VSS VSS XOR Vhigh = 1.8 Vlow = 0 Trise = {tff_rise} Tfall = {tff_rise} Td = {td_DFF}
V10 VCLK 0 PULSE({VSS} {VDD} {Tp} 500p 500p {Tp} {T})
A26 VCLK 0 0 0 0 ~VCLK 0 0 BUF Vhigh = 1.8 Vlow = 0 Trise = {tff_rise} Tfall = {tff_rise} Td = {td_DFF}
V11 VSS 0 0
A27 N009 VSS VCLK VSS VSS VSS N010 VSS DFLOP Vhigh = 1.8 Vlow = 0 Trise = {tff_rise} Tfall = {tff_rise} Td = {td_DFF}
A28 N010 VSS VCLK VSS VSS VSS N002 VSS DFLOP Vhigh = 1.8 Vlow = 0 Trise = {tff_rise} Tfall = {tff_rise} Td = {td_DFF}
A29 N002 VSS VCLK VSS VSS VSS N011 VSS DFLOP Vhigh = 1.8 Vlow = 0 Trise = {tff_rise} Tfall = {tff_rise} Td = {td_DFF}
A30 N011 VSS VCLK VSS VSS VSS N001 VSS DFLOP Vhigh = 1.8 Vlow = 0 Trise = {tff_rise} Tfall = {tff_rise} Td = {td_DFF}
.include tsmc018.txt
.LIB opamp.sub
.model MYSW SW(Ron=1 Roff=100Meg Vt=.9 Vh=0)
.ic V(vp) = 0 V(Q0) = 0 V(Q1) = 0 V(D0) = 0 V(D1) = 0
.options gmin = 1e-10
.options abstol = 1e-10
.options reltol = 0.003
.param G = 0.0001
.tran {200*T} uic
.param td_DFF = 50p tff_rise = 50p
.param VDD=1.8V VSS=0V T=40n Tp=20n Tp1=20n
.param X = 0.23
.include tsmc018.txt
.param td_DFF = 50p tff_rise = 50p
.param VDD=1.8V VSS=0V T=40n Tp=20n Tp1=20n
.tran {500*T}
.options gmin = 1e-10
.options abstol = 1e-10
.options reltol = 0.003
.ic V(Q0) = 0 V(Q1) = 0 V(D0) = 0 V(D1) = 0
* 11
* 9
.backanno
.end